# Altium project PCB_DoXe_7SEG_Arduino.PrjPcb
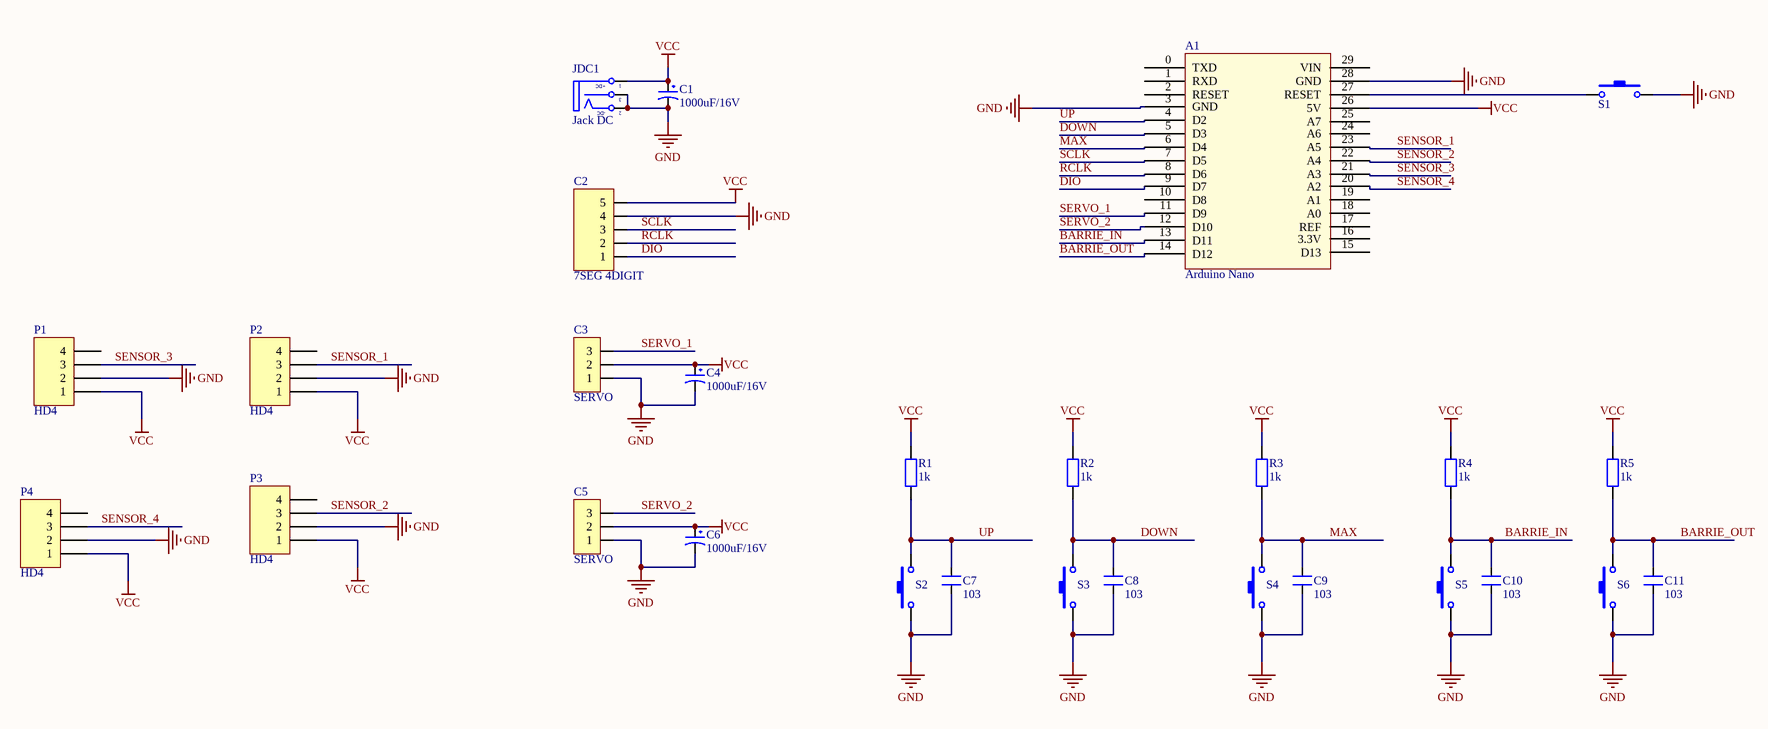
[diagram p0: DoXe_7SEG_Arduino.SchDoc]
1 sheet, 28 parts. Net scope: global (net labels, ports and power ports of the same name join across sheets).
Board file: DoXe_7SEG_Arduino.PcbDoc

## Sheet DoXe_7SEG_Arduino.SchDoc
size A0

### Parts
A1  Arduino Nano  [Arduino Nano_JUMP]
C1  1000uF/16V  [CP1.5/3.4]
C2  7SEG 4DIGIT  [JP5-D1T]
C3  SERVO  [JP3-D1T]
C4  1000uF/16V  [CP1.5/3.4]
C5  SERVO  [JP3-D1T]
C6  1000uF/16V  [CP1.5/3.4]
C7  103  [SM-0805]
C8  103  [SM-0805]
C9  103  [SM-0805]
C10  103  [SM-0805]
C11  103  [SM-0805]
JDC1  Jack DC  [DC0]
P1  HD4  [HEADER 4]
P2  HD4  [HEADER 4]
P3  HD4  [HEADER 4]
P4  HD4  [HEADER 4]
R1  1k  [RES-1/4W]
R2  1k  [RES-1/4W]
R3  1k  [RES-1/4W]
R4  1k  [RES-1/4W]
R5  1k  [RES-1/4W]
S1  SW  [BUTTON  ROUND]  (value not drawn)
S2  SW  [BUTTON  ROUND]  (value not drawn)
S3  SW  [BUTTON  ROUND]  (value not drawn)
S4  SW  [BUTTON  ROUND]  (value not drawn)
S5  SW  [BUTTON  ROUND]  (value not drawn)
S6  SW  [BUTTON  ROUND]  (value not drawn)

### Nets
GND: A1.3(GND) A1.28(GND) C1.2 C2.4 C3.1 C4.2 C5.1 C6.2 C7.1 C8.1 C9.1 C10.1 C11.1 JDC1.2(TN) JDC1.3(S) P1.2 P2.2 P3.2 P4.2 S1.2 S2.1 S3.1 S4.1 S5.1 S6.1
VCC: A1.26(5V) C1.1 C2.5 C3.2 C4.1 C5.2 C6.1 JDC1.1(T) P1.1 P2.1 P3.1 P4.1 R1.2 R2.2 R3.2 R4.2 R5.2
BARRIE_IN: A1.13(D11) C10.2 R4.1 S5.2
BARRIE_OUT: A1.14(D12) C11.2 R5.1 S6.2
DIO: A1.9(D7) C2.1
DOWN: A1.5(D3) C8.2 R2.1 S3.2
MAX: A1.6(D4) C9.2 R3.1 S4.2
RCLK: A1.8(D6) C2.2
SCLK: A1.7(D5) C2.3
SENSOR_1: A1.23(A5) P2.3
SENSOR_2: A1.22(A4) P3.3
SENSOR_3: A1.21(A3) P1.3
SENSOR_4: A1.20(A2) P4.3
SERVO_1: A1.11(D9) C3.3
SERVO_2: A1.12(D10) C5.3
UP: A1.4(D2) C7.2 R1.1 S2.2
NetA1_27: A1.27(RESET) S1.1

Not connected (* = marked no-connect by the designer): A1 0(TXD) 1(RXD) 2(RESET) 10(D8) 15(D13) 16(3.3V) 17(REF) 18(A0) 19(A1) 24(A6) 25(A7) 29(VIN); P1 4; P2 4; P3 4; P4 4

### Notes on the sheet
- (in symbol JACK_DC) +DC; -DC

### Library data of the parts
C1 C4 C6 = CP4: Cap 1000uF/16V - 220uF/50V; Description 5: 4,7uF>10uF/250V_3,3uF>10uF/400V - 2,2uF>4,7uF/450V; Description 1: 2200uF-3300uF/6,3V - 1000uF-2200uF/10V; Description 2: 1000uF/16V - 470uF => 1000uF/25V - 100uF/100V; Description 3: 330uF>470uF/35V_220uF>470uF/50V_10uF>22uF/250V; Description 4: 220uF => 330uF/63V - 10uF =>33uF/160 - 200V; Value: 1000uF/16V
C2 = JP5: WR-PHD 2.54 mm Angled Socket Header; Manufacturer: W¨¹rth Elektronik eiSos GmbH; partNo: 613005143121; ComponentLink1 Description: Manufacturer; ComponentLink2 Description: Datasheet; NoPins: 05; Created Date: 29 March 2013; ComponentLink1URL: http://www.we-online.com; ComponentLink2URL: http://katalog.we-online.de/em/datasheet/6130xx143121.pdf; Created by: Karrer Zheng
C3 C5 = JP3: WR-PHD 2.54 mm Angled Socket Header; Manufacturer: W¨¹rth Elektronik eiSos GmbH; partNo: 613003143121; ComponentLink1 Description: Manufacturer; ComponentLink2 Description: Datasheet; NoPins: 03; Created Date: 29 March 2013; ComponentLink1URL: http://www.we-online.com; ComponentLink2URL: http://katalog.we-online.de/em/datasheet/6130xx143121.pdf; Created by: Karrer Zheng
C7-C11 = CM: Cap SMD; Value: 103
JDC1 = JACK_DC
P1-P4 = HEADER 4
R1-R5 = R: Resistor R1/4W
S1-S6 = SW-Button: Switch-Button; Published: 24-Mar-1999; LatestRevisionDate: 17-Jul-2002; LatestRevisionNote: Re-released for DXP Platform.; PackageReference: SPST-2; Publisher: Altium Limited